# Altium project PCB_Project_MachCamBienMQ3.PrjPcb
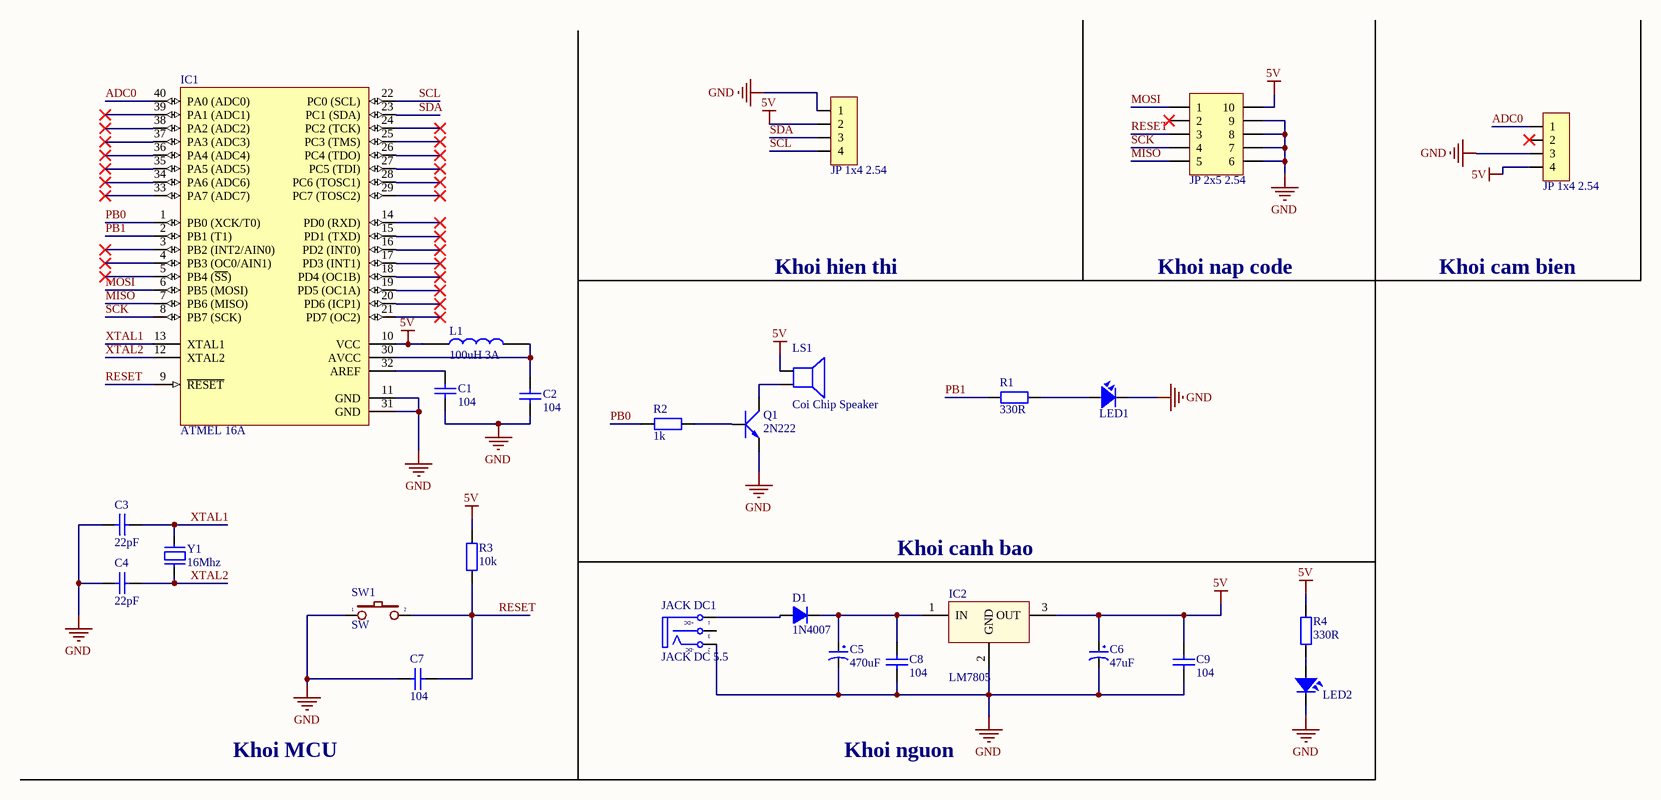
[diagram p0: Sheet_MachMQ3.SchDoc]
1 sheet, 27 parts. Net scope: global (net labels, ports and power ports of the same name join across sheets).
Board file: PCB_MachMQ3.PcbDoc

## Sheet Sheet_MachMQ3.SchDoc
size B; SheetNumber: 1; SheetTotal: 1

### Parts
C1  104  [tu gom]
C2  104  [tu gom]
C3  22pF  [tu gom]
C4  22pF  [tu gom]
C5  470uF  [tu hoa 8mm]
C6  47uF  [tu hoa 5mm]
C7  104  [tu gom]
C8  104  [tu gom]
C9  104  [tu gom]
D1  1N4007  [D1A]
IC1  ATMEL 16A  [DIP40/W0.6]
IC2  LM7805  [QTO-220H3]
JACK_DC1  JACK DC 5.5  [JACK DC 5.5]
JP1  JP 1x4 2.54  [JP 1x4 CT]
JP2  JP 2x5 2.54  [JP 2x5 DT]
JP3  JP 1x4 2.54  [JP 1x4 CT]
L1  100uH 3A  [CUON CAM 100uH3A]
LED1  LED  [LED-3MM-RED]  (value not drawn)
LED2  LED  [LED-3MM-RED]  (value not drawn)
LS1  Coi Chip Speaker  [Coi Chip Speacker]
Q1  2N222  [TO92-123]
R1  330R  [tro vach 1/2w]
R2  1k  [tro vach 1/2w]
R3  10k  [tro vach 1/2w]
R4  330R  [tro vach 1/2w]
SW1  SW  [SW2]
Y1  16Mhz  [Thach Anh 2 chan cam]

### Nets
5V: C6.1 C9.1 IC1.10(VCC) IC2.3(OUT) JP1.4 JP2.10 JP3.2 L1.1 LS1.1 R3.2 R4.2
GND: C1.2 C2.2 C3.2 C4.2 C5.2 C6.2 C7.2 C8.2 C9.2 IC1.11(GND) IC1.31(GND) IC2.2(GND) JACK_DC1.2(TN) JP1.3 JP2.6 JP2.7 JP2.8 JP2.9 JP3.1 LED1.2 LED2.2 Q1.1(E) SW1.1
ADC0: IC1.40(PA0_(ADC0)) JP1.1
MISO: IC1.7(PB6_(MISO)) JP2.5
MOSI: IC1.6(PB5_(MOSI)) JP2.1
PB0: IC1.1(PB0_(XCK/T0)) R2.1
PB1: IC1.2(PB1_(T1)) R1.1
RESET: C7.1 IC1.9(~{RESET}) JP2.3 R3.1 SW1.2
SCK: IC1.8(PB7_(SCK)) JP2.4
SCL: IC1.22(PC0_(SCL)) JP3.4
SDA: IC1.23(PC1_(SDA)) JP3.3
XTAL1: C3.1 IC1.13(XTAL1) Y1.2
XTAL2: C4.1 IC1.12(XTAL2) Y1.1
NetC1_1: C1.1 IC1.32(AREF)
NetC2_1: C2.1 IC1.30(AVCC) L1.2
NetC5_1: C5.1 C8.1 D1.2(K) IC2.1(IN)
NetD1_1: D1.1(A) JACK_DC1.1(T)
NetLED1_1: LED1.1 R1.2
NetLED2_1: LED2.1 R4.1
NetLS1_2: LS1.2 Q1.3(C)
NetQ1_2: Q1.2(B) R2.2

Not connected (* = marked no-connect by the designer): IC1 3(PB2_(INT2/AIN0))* 4(PB3_(OC0/AIN1))* 5(PB4_(~{SS}))* 14(PD0_(RXD))* 15(PD1_(TXD))* 16(PD2_(INT0))* 17(PD3_(INT1))* 18(PD4_(OC1B))* 19(PD5_(OC1A))* 20(PD6_(ICP1))* 21(PD7_(OC2))* 24(PC2_(TCK))* 25(PC3_(TMS))* 26(PC4_(TDO))* 27(PC5_(TDI))* 28(PC6_(TOSC1))* 29(PC7_(TOSC2))* 33(PA7_(ADC7))* 34(PA6_(ADC6))* 35(PA5_(ADC5))* 36(PA4_(ADC4))* 37(PA3_(ADC3))* 38(PA2_(ADC2))* 39(PA1_(ADC1))*; JACK_DC1 3(S); JP1 2*; JP2 2*

### Notes on the sheet
- Khoi hien thi
- Khoi nap code
- Khoi cam bien
- (near IC2) Khoi canh bao
- Khoi MCU
- Khoi nguon
- (in symbol JACK DC 5.5) +DC; -DC

### Library data of the parts
C1 C2 C7-C9 = Tu gom 104 50V: Cắm; So_Chan: 2; Ten_Linh_Kien: Tụ gốm 104 100nF 50V; Don_Vi: Con; Ma_Hang: MH004761; Chung_Loai: Cắm; Kieu_Chan: *
C3 C4 = Tu gom 22pF 50V: Cắm; Don_Vi: Con; So_Chan: 2; Ten_Linh_Kien: Tụ gốm 22P 50V; Ma_Hang: MH004771; Chung_Loai: Cắm; Kieu_Chan: *
C5 = Tu Hoa 470uF 16V 8x11: Cắm; Don_Vi: Con; So_Chan: 2; Ten_Linh_Kien: Tụ Hóa 470uF 16V 8x11MM; Ma_Hang: MH006550; Chung_Loai: Cắm; Kieu_Chan: *
C6 = Tu Hoa 47uF 16V 5x10: Cắm; Don_Vi: Con; So_Chan: 2; Ten_Linh_Kien: Tụ Hóa 47uF 16V; Ma_Hang: MH006859; Chung_Loai: Cắm; Kieu_Chan: *
D1 = D1A: Diode 1A; Value: 1N4007
IC1 = ATmega16A-PU: 8-Bit AVR Microcontroller with 16K Bytes of In-System Programmable Flash Memory; Value: Atmega 16L
IC2 = LM78xx: On ap +, from + 5 to + 24VDC; Value: LM7805
JACK_DC1 = JACK DC 5.5: Value: Jac DC
JP1 JP3 = JP 1x4 2.54 Cai Thang: Cắm; Ten_Linh_Kien: Jump Đơn Cái 2.54MM 1x20P Thẳng; Don_Vi: Con; Ma_Hang: MH004006; Ghi_Chu: *; Kieu_Chan: *; Chung_Loai: Cắm
JP2 = JP 2x5 2.54 Duc Thang: Cắm; Ten_Linh_Kien: Jump Đôi Đực 2.54MM 2x40P Thẳng 11MM; Don_Vi: Con; Ma_Hang: MH002686; Ghi_Chu: *; Kieu_Chan: *; Chung_Loai: Cắm
L1 = CUON CAM 100uH DIP: Dán; Don_Vi: Con; Ma_Hang: MH002209; Ten_Linh_Kien: Cuộn Cảm 100uH 3A 8x10MM; Chung_Loai: Dán; Ghi Chu: *; Kieu Chan: *
LED1 LED2 = LED: LED Single colour Green and Red; Value: LED 3 ly Single Colour
LS1 = Coi Chip Speaker: Còi chip
Q1 = 2N222: NPN 600mW, ECB; Value: C1815
R1 R4 = Tro Vach 1/2W 5% 330R: Cắm; Don_Vi: Con; So_Chan: 2; Ten_Linh_Kien: Trở 5% 1/2w 330R; Ma_Hang: MH006204; Chung_Loai: Cắm; Kieu_Chan: *
R2 = Tro Vach 1/2W 5% 1k: Cắm; Don_Vi: Con; So_Chan: 2; Ten_Linh_Kien: Trở 5% 1/2w 1K; Ma_Hang: MH007240; Chung_Loai: Cắm; Kieu_Chan: *
R3 = Tro Vach 1/2W 5% 10k: Cắm; Don_Vi: Con; So_Chan: 2; Ten_Linh_Kien: Trở 5% 1/2w 10k; Ma_Hang: MH006206; Chung_Loai: Cắm; Kieu_Chan: *
SW1 = SW2: Switch button 2 pin; Value: SW chip 2 pin
Y1 = Thach Anh 2 chan Cam: Crystal For all Crystal 2pin.; Value: 4Mhz